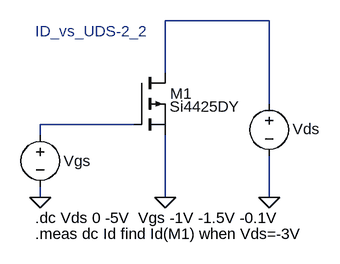
[diagram p0: schematic ID_vs_UDS-2_2.asc]
ID_vs_UDS-2_2.asc, the LTspice schematic file:
Version 4
SHEET 1 1292 680
WIRE -560 -144 -720 -144
WIRE -720 -64 -720 -144
WIRE -560 -16 -560 -144
WIRE -768 16 -912 16
WIRE -912 32 -912 16
WIRE -912 128 -912 112
WIRE -720 128 -720 32
WIRE -560 128 -560 64
FLAG -560 128 0
FLAG -912 128 0
FLAG -720 128 0
SYMBOL voltage -560 -32 R0
WINDOW 123 0 0 Left 2
WINDOW 39 37 60 Left 2
WINDOW 0 36 55 Left 2
WINDOW 3 37 60 Left 2
SYMATTR InstName Vds
SYMATTR Value ""
SYMBOL voltage -912 16 R0
WINDOW 123 0 0 Left 2
WINDOW 39 40 53 Left 2
WINDOW 3 40 69 Left 2
WINDOW 0 36 56 Left 2
SYMATTR Value ""
SYMATTR InstName Vgs
SYMBOL pmos -768 -64 R0
WINDOW 3 55 52 Left 2
SYMATTR Value Si4425DY
SYMATTR InstName M1
TEXT -920 160 Left 2 !.dc Vds 0 -5V  Vgs -1V -1.5V -0.1V
TEXT -920 184 Left 2 !.meas dc Id find Id(M1) when Vds=-3V
TEXT -920 -128 Left 2 ;ID_vs_UDS-2_2

The netlist it stands for:
* ID_vs_UDS-2_2.asc
Vds N001 0
Vgs N002 0
M1 N001 N002 0 0 Si4425DY
.model NMOS NMOS
.model PMOS PMOS
.lib standard.mos
.dc Vds 0 -5V  Vgs -1V -1.5V -0.1V
.meas dc Id find Id(M1) when Vds=-3V
* ID_vs_UDS-2_2
.backanno
.end